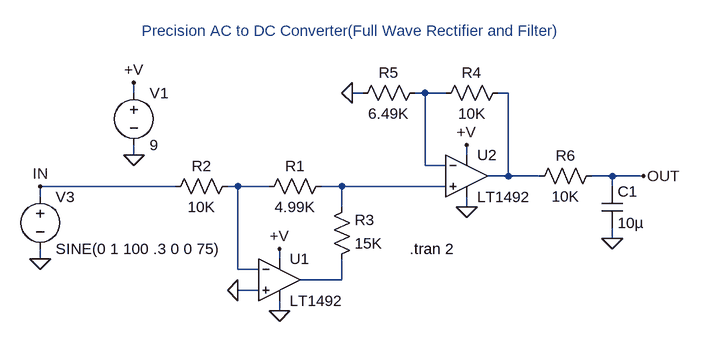
[diagram p0: schematic 1492.asc]
1492.asc, the LTspice schematic file:
Version 4
SHEET 1 896 680
WIRE -32 -48 -32 -64
WIRE 320 -48 304 -48
WIRE 416 -48 400 -48
WIRE 448 -48 416 -48
WIRE 544 -48 528 -48
WIRE -32 48 -32 32
WIRE 480 48 480 32
WIRE 416 64 416 -48
WIRE 448 64 416 64
WIRE 544 80 544 -48
WIRE 544 80 512 80
WIRE 592 80 544 80
WIRE 704 80 672 80
WIRE 752 80 704 80
WIRE 32 96 -176 96
WIRE 128 96 112 96
WIRE 176 96 128 96
WIRE 288 96 256 96
WIRE 448 96 288 96
WIRE 704 96 704 80
WIRE -176 112 -176 96
WIRE 288 128 288 96
WIRE 480 128 480 112
WIRE 704 176 704 160
WIRE -176 208 -176 192
WIRE 192 208 192 192
WIRE 128 224 128 96
WIRE 160 224 128 224
WIRE 288 240 288 208
WIRE 288 240 224 240
WIRE 160 256 128 256
WIRE 192 288 192 272
FLAG -32 48 0
FLAG 192 192 +V
FLAG -32 -64 +V
FLAG -176 208 0
FLAG 128 256 0
FLAG 192 288 0
FLAG 480 32 +V
FLAG 480 128 0
FLAG 304 -48 0
FLAG 704 176 0
FLAG 752 80 OUT
FLAG -176 96 IN
SYMBOL voltage -32 -64 R0
SYMATTR InstName V1
SYMATTR Value 9
SYMBOL res 272 80 R90
WINDOW 0 0 56 VBottom 2
WINDOW 3 32 56 VTop 2
SYMATTR InstName R1
SYMATTR Value 4.99K
SYMBOL res 128 80 R90
WINDOW 0 0 56 VBottom 2
WINDOW 3 32 56 VTop 2
SYMATTR InstName R2
SYMATTR Value 10K
SYMBOL voltage -176 96 R0
WINDOW 123 0 0 Left 2
WINDOW 39 0 0 Left 2
SYMATTR InstName V3
SYMATTR Value SINE(0 1 100 .3 0 0 75)
SYMBOL opamps\\LT1492 192 176 R0
SYMATTR InstName U1
SYMBOL res 272 224 M180
WINDOW 0 36 76 Left 2
WINDOW 3 36 40 Left 2
SYMATTR InstName R3
SYMATTR Value 15K
SYMBOL opamps\\LT1492 480 16 R0
SYMATTR InstName U2
SYMBOL res 544 -64 R90
WINDOW 0 0 56 VBottom 2
WINDOW 3 32 56 VTop 2
SYMATTR InstName R4
SYMATTR Value 10K
SYMBOL res 416 -64 R90
WINDOW 0 0 56 VBottom 2
WINDOW 3 32 56 VTop 2
SYMATTR InstName R5
SYMATTR Value 6.49K
SYMBOL res 688 64 R90
WINDOW 0 0 56 VBottom 2
WINDOW 3 32 56 VTop 2
SYMATTR InstName R6
SYMATTR Value 10K
SYMBOL cap 688 96 R0
SYMATTR InstName C1
SYMATTR Value 10µ
TEXT 392 192 Left 2 !.tran 2
TEXT 304 -128 Bottom 2 ;Precision AC to DC Converter(Full Wave Rectifier and Filter)

The netlist it stands for:
* 1492.asc
V1 +V 0 9
R1 N004 N003 4.99K
R2 N003 IN 10K
V3 IN 0 SINE(0 1 100 .3 0 0 75)
XU1 0 N003 +V 0 N005 LT1492  ; pins In+ In- V+ V- OUT
R3 N005 N004 15K
XU2 N004 N001 +V 0 N002 LT1492  ; pins In+ In- V+ V- OUT
R4 N002 N001 10K
R5 N001 0 6.49K
R6 OUT N002 10K
C1 OUT 0 10µ
.tran 2
* Precision AC to DC Converter(Full Wave Rectifier and Filter)
.backanno
.end